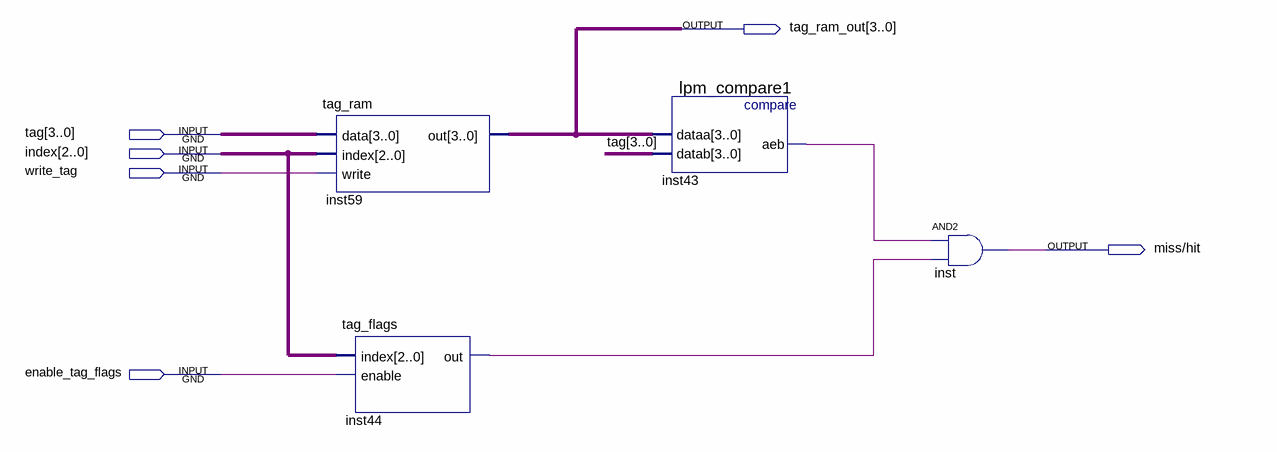
[diagram p0: schematic sheet]
// Quartus schematic tags_module.bdf as structural Verilog: 4 symbols, 6 pins
module tags_module (
  input  [3:0] tag,
  input  [2:0] index,
  input  write_tag,
  input  enable_tag_flags,
  output [3:0] tag_ram_out,
  output \miss/hit 
);

  wire inst43_aeb, inst44_out;

  tag_ram inst59 (.data(tag), .index(index), .write(write_tag), .out(tag_ram_out));
  tag_flags inst44 (.index(index), .enable(enable_tag_flags), .out(inst44_out));
  lpm_compare1 inst43 (.dataa(tag_ram_out), .datab(tag), .aeb(inst43_aeb));
  and inst (\miss/hit , inst43_aeb, inst44_out);
endmodule
